# EasyEDA Pro project V2.0.1 Expansion Card.epro

# Schematic V2.0.1 Schematic
Board Name: <System Assignment>; Create Date: 2024-10-24; Page Name: Main Page; Project Name: Access Control Expansion Card; Schematic Name: V2.0.1 Schematic; Update Date: 2024-10-30
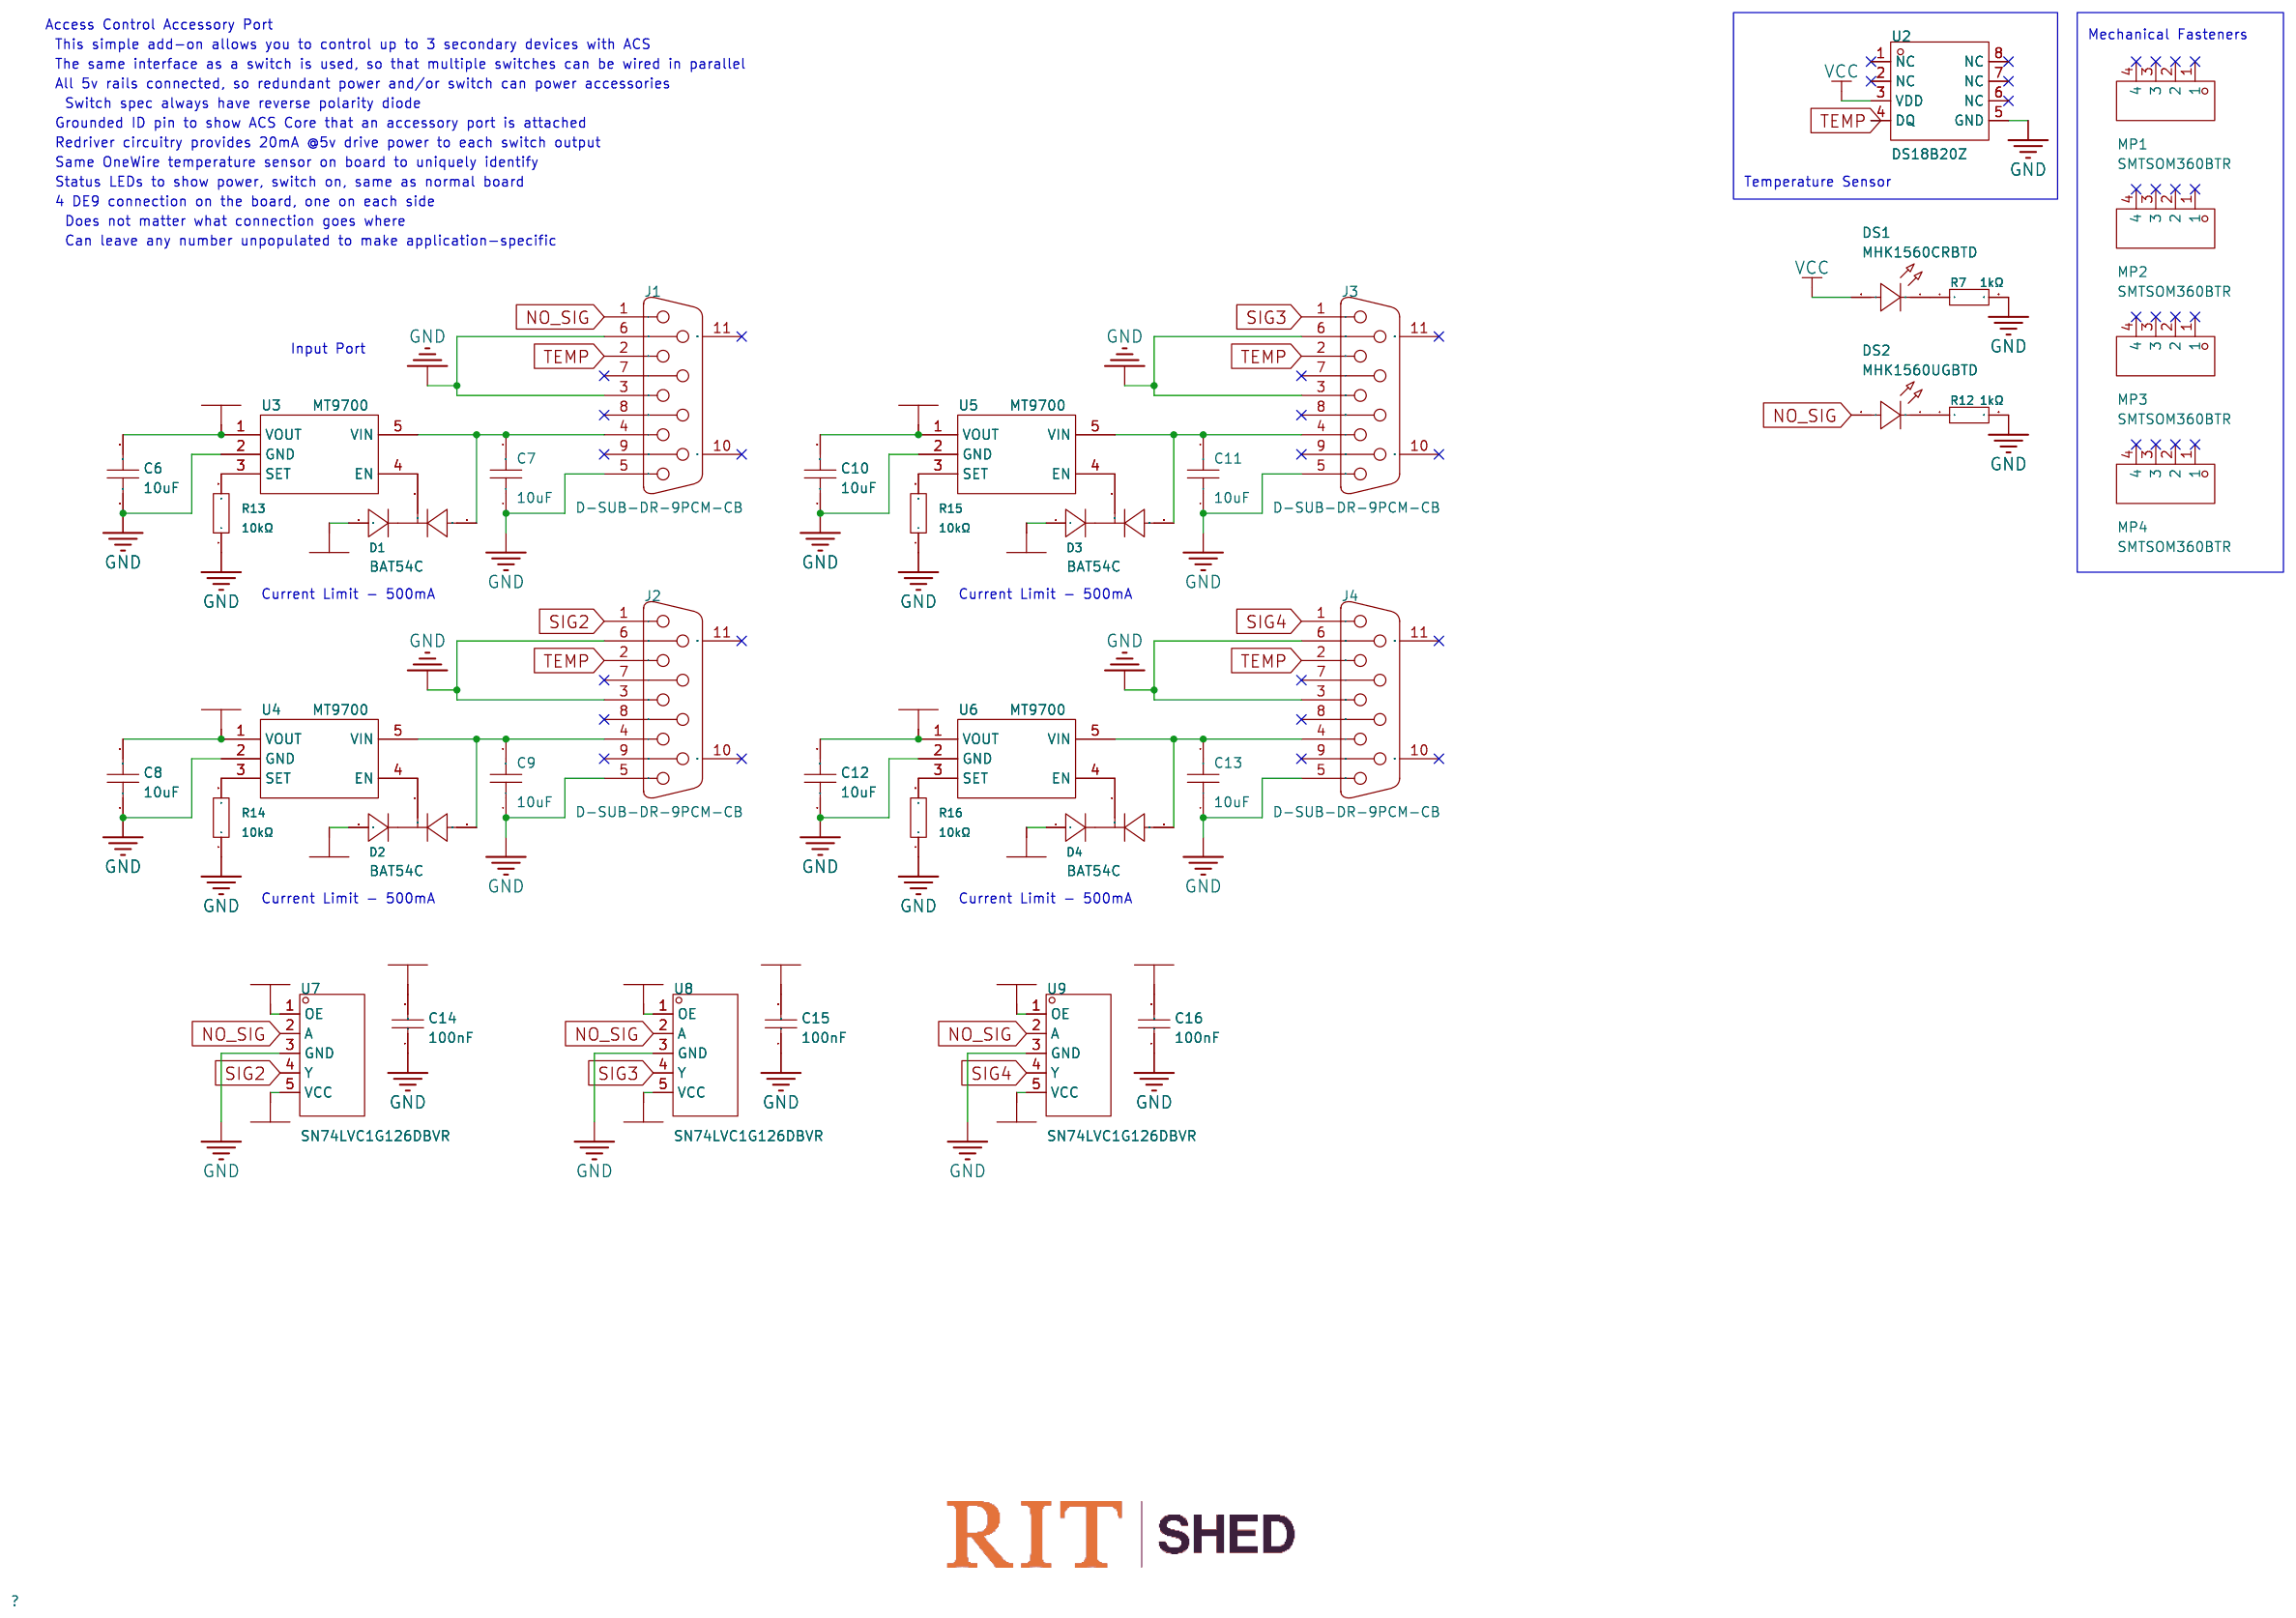
[diagram p0: schematic sheet]

## Parts
C6  10uF  [C0603]
C7  10uF  [C0603]
C8  10uF  [C0603]
C9  10uF  [C0603]
C10  10uF  [C0603]
C11  10uF  [C0603]
C12  10uF  [C0603]
C13  10uF  [C0603]
C14  100nF  [C0603]
C15  100nF  [C0603]
C16  100nF  [C0603]
D1  BAT54C  [SOT-23-3_L2.9-W1.3-P1.90-LS2.4-BR]
D2  BAT54C  [SOT-23-3_L2.9-W1.3-P1.90-LS2.4-BR]
D3  BAT54C  [SOT-23-3_L2.9-W1.3-P1.90-LS2.4-BR]
D4  BAT54C  [SOT-23-3_L2.9-W1.3-P1.90-LS2.4-BR]
DS1  MHK1560CRBTD  [LED-TH_MHK1560UGBTD]
DS2  MHK1560UGBTD  [LED-TH_MHK1560UGBTD]
J1  D-SUB-DR-9PCM-CB  [DB9-TH_ID09S33E4GV00LF]
J2  D-SUB-DR-9PCM-CB  [DB9-TH_ID09S33E4GV00LF]
J3  D-SUB-DR-9PCM-CB  [DB9-TH_ID09S33E4GV00LF]
J4  D-SUB-DR-9PCM-CB  [DB9-TH_ID09S33E4GV00LF]
MP1  SMTSOM360BTR  [SMD_BD5.6-D4.1]
MP2  SMTSOM360BTR  [SMD_BD5.6-D4.1]
MP3  SMTSOM360BTR  [SMD_BD5.6-D4.1]
MP4  SMTSOM360BTR  [SMD_BD5.6-D4.1]
R7  1kΩ  [R0603]
R12  1kΩ  [R0603]
R13  10kΩ  [R0603]
R14  10kΩ  [R0603]
R15  10kΩ  [R0603]
R16  10kΩ  [R0603]
U2  DS18B20Z  [SOP-8_L4.9-W3.9-P1.27-LS6.0-BL]
U3  MT9700  [SOT-23-5_L3.0-W1.7-P0.95-LS2.8-BR]
U4  MT9700  [SOT-23-5_L3.0-W1.7-P0.95-LS2.8-BR]
U5  MT9700  [SOT-23-5_L3.0-W1.7-P0.95-LS2.8-BR]
U6  MT9700  [SOT-23-5_L3.0-W1.7-P0.95-LS2.8-BR]
U7  SN74LVC1G126DBVR  [SOT-23-5_L3.0-W1.7-P0.95-LS2.8-BR]
U8  SN74LVC1G126DBVR  [SOT-23-5_L3.0-W1.7-P0.95-LS2.8-BR]
U9  SN74LVC1G126DBVR  [SOT-23-5_L3.0-W1.7-P0.95-LS2.8-BR]

## Library data of the parts
C6-C13 = CL10A106MA8NRNC: Capacitance: Tolerance:±20% Tolerance:±20% Voltage Rated: Temperature Coefficient:; LCSC Part Name: 10uF ±20% 25V; Supplier Part: C96446; Manufacturer: SAMSUNG(三星); Supplier Footprint: 0603; Datasheet: https://atta.szlcsc.com/upload/public/pdf/source/20170325/1490427913016.pdf; Supplier: LCSC; Tolerance: ±20%
C14-C16 = CL10B104KA8NNNC: Capacitance: Tolerance:±10% Tolerance:±10% Voltage Rated: Temperature Coefficient:; LCSC Part Name: 100nF ±10% 25V; Supplier Part: C1590; Manufacturer: SAMSUNG(三星); Supplier Footprint: 0603; JLCPCB Part Class: Extended Part; Datasheet: https://atta.szlcsc.com/upload/public/pdf/source/20160218/1457707763339.pdf; Supplier: LCSC; Tolerance: ±10%
D1-D4 = BAT54C_C2903788: Diode Configuration: Forward Voltage (Vf@If): Reverse Voltage (Vr): Average Rectified Current (Io): Reverse Leakage Current:2uA@25V; LCSC Part Name: 电压:30V 电流:200mA; Supplier Part: C2903788; Manufacturer: LGE(鲁光); Supplier Footprint: SOT-23; Datasheet: https://atta.szlcsc.com/upload/public/pdf/source/20211009/E66F01CF3E57E3FB5B3EEE30F10FBF56.pdf; Supplier: LCSC; Reverse Leakage Current: 2uA@25V
DS1 = MHK1560CGBTD: 20mA 雾状红透镜 50mcd -40℃~+85℃ 632nm Red 85° 1.75V~2.2V Plugin,P=2.54mm Light Emitting Diodes (LED) ROHS; LCSC Part Name: 1560直插单灯翠绿色光; Supplier Part: C7470835; Manufacturer: MEIHUA(美华); Supplier Footprint: 插件,P=2.54mm; JLCPCB Part Class: Extended Part; Datasheet: https://atta.szlcsc.com/upload/public/pdf/source/20231114/0151DB1F997DCF286213A722D08B4BAA.pdf; Supplier: LCSC; Emitted Color: Emerald; Forward Voltage (VF): 1.75V~2.2V; Forward Current: 20mA; Dominant Wavelength: 520nm; Lens Color: 雾状绿透镜; Luminous Intensity: 1000mcd; Viewing Angle: 85°; Operating Temperature: -40℃~+85℃
DS2 = MHK1560UGBTD: Emitted Color:Emerald Forward Voltage (VF):1.75V~2.2V Forward Voltage (VF):1.75V~2.2V Forward Current:20mA Dominant Wavelength:520nm Dominant Wavelength:520nm Lens Color:雾状绿透镜 Luminous Intensity:1000mcd Luminous Intensity:1000mcd Viewing Angle:85° Operati; LCSC Part Name: 1560直插单灯翠绿色光; Supplier Part: C7470833; Manufacturer: MEIHUA(美华); Supplier Footprint: 插件,P=2.54mm; JLCPCB Part Class: Extended Part; Datasheet: https://atta.szlcsc.com/upload/public/pdf/source/20231114/0151DB1F997DCF286213A722D08B4BAA.pdf; Supplier: LCSC; Emitted Color: Emerald; Forward Voltage (VF): 1.75V~2.2V; Forward Current: 20mA; Dominant Wavelength: 520nm; Lens Color: 雾状绿透镜; Luminous Intensity: 1000mcd; Viewing Angle: 85°; Operating Temperature: -40℃~+85℃
J1-J4 = D-SUB-DR-9PCM-CB: Connector Type:D-Sub Gender:Female Number of Pins:9P Mounting Style:Right-Angle Number of Rows:2 Current Rating (Max):3A Contact Plating:Tin Operating Temperature Range:-50℃~+105℃ Operating Temperature Range:-50℃~+105℃; LCSC Part Name: D-Sub 母 P数:9P; Supplier Part: C19077337; Manufacturer: XUNPU(讯普); Supplier Footprint: 弯插; JLCPCB Part Class: Extended Part; Datasheet: https://atta.szlcsc.com/upload/public/pdf/source/20231108/FB2E8AB0BE4F620DDF3F7F4D0B9AFB97.pdf; Supplier: LCSC; Connector Type: D-Sub; Gender: Female; Number of Pins: 9P; Mounting Style: Right-Angle; Number of Rows: 2; Current Rating (Max): 3A; Contact Plating: Tin; Operating Temperature Range: -50℃~+105℃
MP1-MP4 = SMTSOM360BTR: LCSC Part Name: YIYUAN(怡远)M3贴片螺母 铜镀锡 PCB贴片连接器SMTSOM360BTR; Supplier Part: C5221846; Manufacturer: YIYUAN(怡远); JLCPCB Part Class: Extended Part; Datasheet: https://atta.szlcsc.com/upload/public/pdf/source/20230202/A42D22DA7D93D728E13784C4003E4077.pdf; Supplier: LCSC
R7 R12 = 0603WAF1001T5E: Type:Thick Film Resistors Resistance:1kΩ Tolerance:±1% Tolerance:±1% Power(Watts): Overload Voltage (Max): Temperature Coefficient:±100ppm/℃ Temperature Coefficient:±100ppm/℃ Operating Temperature Range:-55℃~+155℃ Operating Temperature Range:-55℃~+155℃; LCSC Part Name: 1kΩ ±1% 100mW 厚膜电阻; Supplier Part: C21190; Manufacturer: UNI-ROYAL(厚声); Supplier Footprint: 0603; JLCPCB Part Class: Basic Part; Datasheet: https://atta.szlcsc.com/upload/public/pdf/source/20200306/C422600_1E6D84923E4A46A82E41ADD87F860B5C.pdf; Supplier: LCSC; Type: Thick Film Resistors; Tolerance: ±1%; Temperature Coefficient: ±100ppm/℃; Operating Temperature Range: -55℃~+155℃
R13-R16 = 0603WAF1002T5E: Type:Thick Film Resistors Resistance:10kΩ Tolerance:±1% Tolerance:±1% Power(Watts): Overload Voltage (Max): Temperature Coefficient:±100ppm/℃ Temperature Coefficient:±100ppm/℃ Operating Temperature Range:-55℃~+155℃ Operating Temperature Range:-55℃~+155℃; LCSC Part Name: 厚膜电阻 10kΩ ±1% 100mW; Supplier Part: C25804; Manufacturer: UNI-ROYAL(厚声); Supplier Footprint: 0603; JLCPCB Part Class: Basic Part; Datasheet: https://atta.szlcsc.com/upload/public/pdf/source/20200306/C422600_1E6D84923E4A46A82E41ADD87F860B5C.pdf; Supplier: LCSC; Type: Thick Film Resistors; Tolerance: ±1%; Temperature Coefficient: ±100ppm/℃; Operating Temperature Range: -55℃~+155℃
U2 = DS18B20Z: Resolution:±0.4℃ Resolution:±0.4℃ Supply Voltage:2.5V~5.5V Supply Voltage:2.5V~5.5V; LCSC Part Name: 温度传感器; Supplier Part: C695837; Manufacturer: UMW(友台半导体); Supplier Footprint: SOIC-8; JLCPCB Part Class: Extended Part; Datasheet: https://atta.szlcsc.com/upload/public/pdf/source/20231109/DC3DA9D47D486EF40A6E0F08B9A498E3.pdf; Supplier: LCSC; Resolution: ±0.4℃; Supply Voltage: 2.5V~5.5V
U3-U6 = MT9700: Supplier Part: C89855; Manufacturer: 西安航天民芯; Supplier Footprint: SOT-23-5; Datasheet: https://atta.szlcsc.com/upload/public/pdf/source/20170418/1492481333031.pdf; Supplier: LCSC
U7-U9 = SN74LVC1G126DBVR: Input type:- output type:Tri-State Supply Voltage:1.65V~5.5V Supply Voltage:1.65V~5.5V Number of Elements:1 Number of Bits per Element:1 Sink Current:32mA Source Current:32mA Logic Family:74LVC Operating Temperature:-40℃~+125℃ Operating Temperature:-40℃~+; Supplier Part: C7834; Manufacturer: TI(德州仪器); Supplier Footprint: SOT-23-5; JLCPCB Part Class: Extended Part; Datasheet: https://www.ti.com/cn/lit/gpn/sn74lvc1g126; Supplier: LCSC; output type: Tri-State; Supply Voltage: 1.65V~5.5V; Number of Elements: 1; Number of Bits per Element: 1; Sink Current: 32mA; Source Current: 32mA; Logic Family: 74LVC; Operating Temperature: -40℃~+125℃

## Nets
GND: C6.1 C7.1 C8.1 C9.1 C10.1 C11.1 C12.1 C13.1 C14.1 C15.1 C16.1 J1.3 J1.5 J1.6 J2.3 J2.5 J2.6 J3.3 J3.5 J3.6 J4.3 J4.5 J4.6 R7.2 R12.2 R13.1 R14.1 R15.1 R16.1 U2.5(GND) U3.2(GND) U4.2(GND) U5.2(GND) U6.2(GND) U7.3(GND) U8.3(GND) U9.3(GND)
VCC: C6.2 C8.2 C10.2 C12.2 C14.2 C15.2 C16.2 D1.1 D2.1 D3.1 D4.1 DS1.2(A) U2.3(VDD) U3.1(VOUT) U4.1(VOUT) U5.1(VOUT) U6.1(VOUT) U7.1(OE) U7.5(VCC) U8.1(OE) U8.5(VCC) U9.1(OE) U9.5(VCC)
NO_SIG: DS2.2(A) J1.1 U7.2(A) U8.2(A) U9.2(A)
SIG2: J2.1 U7.4(Y)
SIG3: J3.1 U8.4(Y)
SIG4: J4.1 U9.4(Y)
TEMP: J1.2 J2.2 J3.2 J4.2 U2.4(DQ)
$1N525: DS1.1(K) R7.1
$1N526: DS2.1(K) R12.1
$1N975: C7.2 D1.2 J1.4 U3.5(VIN)
$1N978: R13.2 U3.3(SET)
$1N2462: D1.3 U3.4(EN)
$1N2824: C9.2 D2.2 J2.4 U4.5(VIN)
$1N2841: R14.2 U4.3(SET)
$1N2842: D2.3 U4.4(EN)
$1N3882: C11.2 D3.2 J3.4 U5.5(VIN)
$1N3899: R15.2 U5.3(SET)
$1N3900: D3.3 U5.4(EN)
$1N3902: R16.2 U6.3(SET)
$1N3903: D4.3 U6.4(EN)
$1N3915: C13.2 D4.2 J4.4 U6.5(VIN)

Not connected (* = marked no-connect by the designer): J1 7* 8* 9* 10(MH1)* 11(MH2)*; J2 7* 8* 9* 10(MH1)* 11(MH2)*; J3 7* 8* 9* 10(MH1)* 11(MH2)*; J4 7* 8* 9* 10(MH1)* 11(MH2)*; MP1 1* 2* 3* 4*; MP2 1* 2* 3* 4*; MP3 1* 2* 3* 4*; MP4 1* 2* 3* 4*; U2 1(NC)* 2(NC)* 6(NC)* 7(NC)* 8(NC)*

## Notes on the sheet
- Access Control Accessory Port
- Mechanical Fasteners
- This simple add-on allows you to control up to 3 secondary devices with ACS
- All 5v rails connected, so redundant power and/or switch can power accessories
- The same interface as a switch is used, so that multiple switches can be wired in parallel
- Switch spec always have reverse polarity diode
- Grounded ID pin to show ACS Core that an accessory port is attached
- Redriver circuitry provides 20mA @5v drive power to each switch output
- Same OneWire temperature sensor on board to uniquely identify
- 4 DE9 connection on the board, one on each side
- Status LEDs to show power, switch on, same as normal board
- Temperature Sensor
- Does not matter what connection goes where
- Can leave any number unpopulated to make application-specific
- Input Port
- Current Limit - 500mA
- Current Limit - 500mA
- Current Limit - 500mA
- Current Limit - 500mA

# Board PCB1
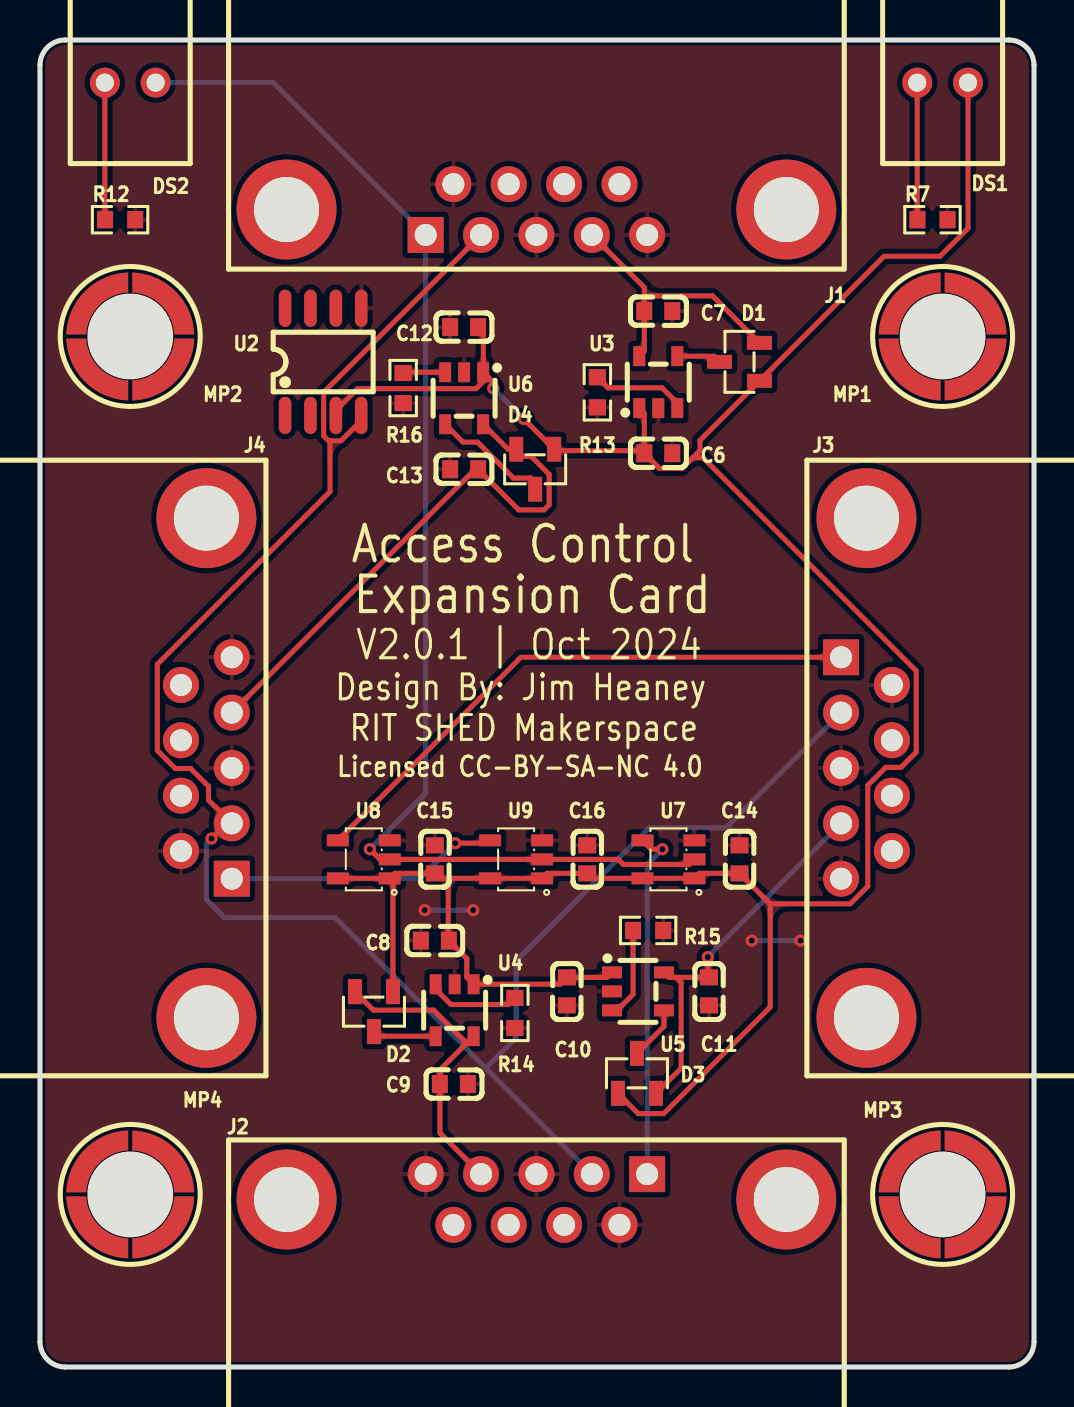
[diagram p1: board, top side]
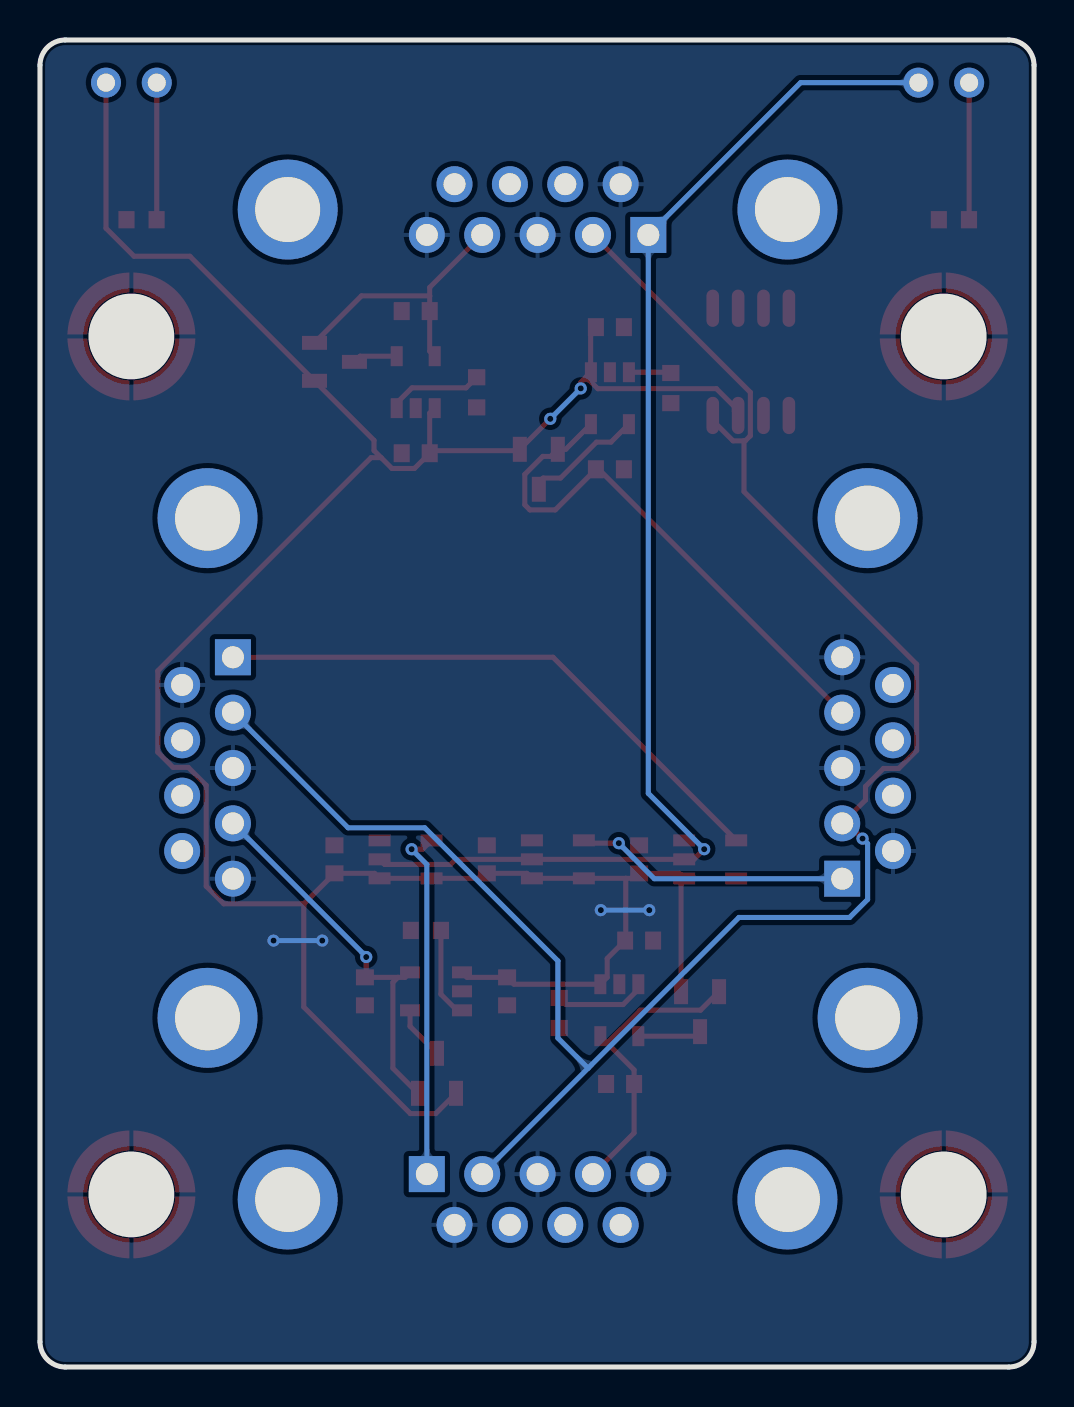
[diagram p2: board, bottom side, seen from below]

Outline 49.73 x 66.4 mm; copper layers: Top Layer, Bottom Layer. Coordinates in mm from the lower left corner of the outline.
Outline path: 0,65.13 0,1.27 arc(0.37,0.37) 1.27,0 48.46,0 arc(49.36,0.37) 49.73,1.27 49.73,65.13 arc(49.36,66.02) 48.46,66.4 1.27,66.4 arc(0.37,66.02) 0,65.13
Stack: Top Layer 0.035mm / Dielectric1 1.51mm FR4 er 4.5 / Bottom Layer 0.035mm

## Design rules (mm)
template: Custom Config
spacing copperThickness1oz (default): track to track 0.152, other pairs 0.152 to 0.3
spacing copperThickness2oz: track to track 0.203, other pairs 0.152 to 0.3
track width copperThickness1oz (default): min 0.127, default 0.254, max 2.54
track width copperThickness2oz: min 0.203, default 0.254, max 2.54
differential pair differentialPair (default): width min 0.127, default 0.254, max 2.54; gap min 0.152, default 0.152
via viaSize (default): diameter min 0.5, default 0.61, max 10; hole min 0.3, default 0.305, max 6.3

## Placement (name value [footprint] x y rotation side)
C6  10uF  [C0603]  30.93 45.72 180 top
C7  10uF  [C0603]  30.93 52.83 180 top
C8  10uF  [C0603]  19.76 21.34 0 top
C9  10uF  [C0603]  20.71 14.16 180 top
C10  10uF  [C0603]  26.36 18.8 90 top
C11  10uF  [C0603]  33.47 18.8 90 top
C12  10uF  [C0603]  21.22 52.03 0 top
C13  10uF  [C0603]  21.22 44.92 0 top
C14  100nF  [C0603]  35 25.4 270 top
C15  100nF  [C0603]  19.76 25.4 270 top
C16  100nF  [C0603]  27.38 25.4 270 top
D1  BAT54C  [SOT-23-3_L2.9-W1.3-P1.90-LS2.4-BR]  35 50.29 0 top
D2  BAT54C  [SOT-23-3_L2.9-W1.3-P1.90-LS2.4-BR]  16.71 17.78 90 top
D3  BAT54C  [SOT-23-3_L2.9-W1.3-P1.90-LS2.4-BR]  29.87 14.69 270 top
D4  BAT54C  [SOT-23-3_L2.9-W1.3-P1.90-LS2.4-BR]  24.77 44.92 90 top
DS1  MHK1560CRBTD  [LED-TH_MHK1560UGBTD]  45.16 64.26 180 top
DS2  MHK1560UGBTD  [LED-TH_MHK1560UGBTD]  4.52 64.26 180 top
J1  D-SUB-DR-9PCM-CB  [DB9-TH_ID09S33E4GV00LF]  24.83 57.91 180 top
J2  D-SUB-DR-9PCM-CB  [DB9-TH_ID09S33E4GV00LF]  24.83 8.38 0 top
J3  D-SUB-DR-9PCM-CB  [DB9-TH_ID09S33E4GV00LF]  41.35 29.97 90 top
J4  D-SUB-DR-9PCM-CB  [DB9-TH_ID09S33E4GV00LF]  8.33 29.97 270 top
MP1  SMTSOM360BTR  [SMD_BD5.6-D4.1]  45.16 51.56 0 top
MP2  SMTSOM360BTR  [SMD_BD5.6-D4.1]  4.52 51.56 0 top
MP3  SMTSOM360BTR  [SMD_BD5.6-D4.1]  45.16 8.64 0 top
MP4  SMTSOM360BTR  [SMD_BD5.6-D4.1]  4.52 8.64 0 top
R7  1kΩ  [R0603]  44.65 57.4 0 top
R12  1kΩ  [R0603]  4.01 57.4 0 top
R13  10kΩ  [R0603]  27.88 48.77 90 top
R14  10kΩ  [R0603]  23.76 17.72 90 top
R15  10kΩ  [R0603]  30.42 21.84 180 top
R16  10kΩ  [R0603]  18.17 48.98 90 top
U2  DS18B20Z  [SOP-8_L4.9-W3.9-P1.27-LS6.0-BL]  14.17 50.29 0 top
U3  MT9700  [SOT-23-5_L3.0-W1.7-P0.95-LS2.8-BR#2]  30.93 49.28 270 top
U4  MT9700  [SOT-23-5_L3.0-W1.7-P0.95-LS2.8-BR#2]  20.74 17.85 90 top
U5  MT9700  [SOT-23-5_L3.0-W1.7-P0.95-LS2.8-BR#2]  29.92 18.8 180 top
U6  MT9700  [SOT-23-5_L3.0-W1.7-P0.95-LS2.8-BR#2]  21.22 48.47 90 top
U7  SN74LVC1G126DBVR  [SOT-23-5_L3.0-W1.7-P0.95-LS2.8-BR]  31.44 25.4 0 top
U8  SN74LVC1G126DBVR  [SOT-23-5_L3.0-W1.7-P0.95-LS2.8-BR]  16.2 25.4 0 top
U9  SN74LVC1G126DBVR  [SOT-23-5_L3.0-W1.7-P0.95-LS2.8-BR]  23.82 25.4 0 top

## Footprints (pads in the part's own frame, mm; a bottom-side part is the same pattern mirrored in y, then rotated)
C0603
  rect 0.8x0.9 smd: 1(-0.7,0) 2(0.7,0)
DB9-TH_ID09S33E4GV00LF
  rect 1.8x1.8 hole 1.1: 1(5.54,1.27)
  round 1.8 hole 1.1: 2(2.77,1.27) 3(0,1.27) 4(-2.77,1.27) 5(-5.54,1.27) 6(4.155,-1.27) 7(1.385,-1.27) 8(-1.385,-1.27) 9(-4.155,-1.27)
  round 5 hole 3.25: 10(-12.5,0) 11(12.5,0)
LED-TH_MHK1560UGBTD
  round 1.5 hole 0.9: 1(1.27,0) 2(-1.27,0)
R0603
  rect 0.806x0.864 smd: 1(-0.753,0) 2(0.753,0)
SMD_BD5.6-D4.1
  custom 3.1x3.1 smd: 1(-2.102,1.65) 2(1.65,2.102) 3(2.102,-1.65) 4(-1.65,-2.102)
SOP-8_L4.9-W3.9-P1.27-LS6.0-BL
  oval 0.63x1.865 smd: 1(-1.905,-2.683) 2(-0.635,-2.683) 3(0.635,-2.683) 4(1.905,-2.683) 5(1.905,2.683) 6(0.635,2.683) 7(-0.635,2.683) 8(-1.905,2.683)
SOT-23-3_L2.9-W1.3-P1.90-LS2.4-BR
  rect 1.25x0.7 smd: 1(1,-0.95) 2(1,0.95) 3(-1,0)
SOT-23-5_L3.0-W1.7-P0.95-LS2.8-BR
  rect 1.1x0.6 smd: 1(1.3,-0.95) 2(1.3,0) 3(1.3,0.95) 4(-1.3,0.95) 5(-1.3,-0.95)
SOT-23-5_L3.0-W1.7-P0.95-LS2.8-BR#2
  rect 1x0.6 smd: 1(1.3,-0.95) 2(1.3,0) 3(1.3,0.95) 4(-1.3,0.95) 5(-1.3,-0.95)

## Nets
As in the schematic.

Pads without a net: J1 7 8 9 10 11; J2 7 8 9 10 11; J3 7 8 9 10 11; J4 7 8 9 10 11; MP1 1 2 3 4; MP2 1 2 3 4; MP3 1 2 3 4; MP4 1 2 3 4; U2 1 2 6 7 8

## Via types
v1: diameter 0.61, hole 0.305, Top Layer to Bottom Layer, 11 vias

## Routing (per net, layer and track width the routed paths; a pad name or vN(x,y) marks a point on that pad's centre or on a via; arc(x,y) is an arc through that point)
GND: length 4.9
  Bottom Layer w0.254: v1(21.67,22.86) v1(19.25,22.86) ; v1(35.61,21.34) v1(38.04,21.34)
VCC: length 142.3
  Top Layer w0.254: 22.41,49.53 22.67,49.26 v1(22.67,48.96) ; 22.41,49.53 22.18,49.76 ; 22.41,49.53 21.82,48.95 15.89,48.95 14.99,48.05 14.99,47.8 U2.3 ; U5.1 28.36,19.5 C10.2 26.02,19.15 U4.1 21.35,19.49 21.35,20.44 C8.2 20.42,21.37 20.42,24.45 ; 17.37,24.45 17.66,24.17 D2.1 ; 17.37,24.45 U8.1 17.75,24.7 C15.2 20.01,24.45 20.42,24.45 ; 17.37,24.45 U8.5 ; D3.1 29.93,12.68 31.2,12.68 36.53,18.01 36.53,23.18 ; 30.23,45.85 C6.2 30.99,44.96 32.12,44.96 32.66,45.5 ; 30.23,45.85 30.23,47.73 U3.1 ; 30.23,45.85 25.79,45.85 D4.1 v1(24.2,47.44) ; 22.18,49.76 22.18,51.76 C12.2 ; 22.18,49.76 U6.1 ; 32.66,45.5 33.17,45.5 43.83,34.83 43.83,30.77 43.07,30 42.31,30 41.41,29.11 41.41,24.06 40.53,23.18 36.53,23.18 ; 32.66,45.5 33.02,45.86 33.02,46.36 D1.1 42.23,55.57 45.02,55.57 46.42,56.98 DS1.2 ; 20.42,24.45 U9.5 U9.1 25.37,24.7 C16.2 27.63,24.45 U7.5 U7.1 32.99,24.7 C14.2 36.52,23.18 36.53,23.18
  Bottom Layer w0.254: v1(24.2,47.44) v1(22.67,48.96)
NO_SIG: length 65.2
  Top Layer w0.254: v1(16.5,25.91) 17.01,25.4 U8.2 U9.2 28.93,25.4 29.18,25.15 32.48,25.15 U7.2
  Bottom Layer w0.254: DS2.2 11.67,64.26 J1.1 19.3,28.7 v1(16.5,25.91)
SIG2: length 17.8
  Top Layer w0.254: v1(31.14,25.91) 30.58,25.91 U7.4
  Bottom Layer w0.254: J2.1 30.38,25.15 v1(31.14,25.91)
SIG3: length 29
  Top Layer w0.254: U8.4 24.06,35.51 J3.1
SIG4: length 13.7
  Top Layer w0.254: U9.4 22.38,26.21 v1(20.77,26.21)
  Bottom Layer w0.254: v1(20.77,26.21) 18.99,24.43 J4.1
TEMP: length 97.5
  Top Layer w0.254: 14.51,46.34 14.51,43.8 5.87,35.16 5.87,30.85 6.77,29.95 7.53,29.95 8.43,29.05 8.43,28.37 J4.2 9.34,27.2 v1(8.58,26.44) ; 14.51,46.34 15.06,46.34 15.95,47.24 15.95,47.49 U2.4 ; 14.51,46.34 14.45,46.34 14.19,46.59 14.19,48.77 J1.2
  Bottom Layer w0.254: J3.2 34.31,26.98 30.48,26.98 23.82,20.32 23.82,16.46 22.31,14.95 ; 22.31,14.95 14.76,22.49 9.22,22.49 8.33,23.39 8.33,26.19 v1(8.58,26.44) ; 22.31,14.95 J2.2
$1N525: length 6.9
  Top Layer w0.254: DS1.1 43.89,57.41 R7.1
$1N526: length 6.9
  Top Layer w0.254: DS2.1 3.25,57.41 R12.1
$1N975: length 14
  Top Layer w0.254: 30.23,53.59 C7.2 30.23,50.83 U3.5 ; 30.23,53.59 33.64,53.59 D1.2 ; 30.23,53.59 30.23,54.02 J1.4
$1N978: length 4.8
  Top Layer w0.254: R13.2 28.41,48.99 31.12,48.99 31.88,48.23 U3.3
$1N2462: length 2.2
  Top Layer w0.254: D1.3 33.71,50.58 U3.4
$1N2824: length 15.2
  Top Layer w0.254: 21.22,16.08 21.22,16.33 19.7,17.86 16.68,17.86 D2.2 ; 21.22,16.08 U4.5 ; 21.22,16.08 20.01,14.86 C9.2 20.01,11.71 J2.4
$1N2841: length 4.7
  Top Layer w0.254: R14.2 23.42,18.14 20.56,18.14 19.79,18.9 U4.3
$1N2842: length 3.2
  Top Layer w0.254: D2.3 16.94,16.55 U4.4
$1N3882: length 19.3
  Top Layer w0.254: 33.41,19.5 v1(33.41,20.51) ; 33.41,19.5 31.82,19.5 ; 33.41,19.5 C11.2 ; 31.82,19.5 32.07,19.24 32.07,14.95 D3.2 ; 31.82,19.5 31.47,19.5 U5.5
  Bottom Layer w0.254: J3.4 33.41,20.53 v1(33.41,20.51)
$1N3899: length 4.6
  Top Layer w0.254: U5.3 28.87,17.85 29.67,18.65 R15.2
$1N3900: length 2.7
  Top Layer w0.254: U5.4 31.22,17.04 D3.3
$1N3902: length 2.1
  Top Layer w0.254: U6.3 18.21,49.77 R16.2
$1N3903: length 6.1
  Top Layer w0.254: U6.4 21.17,46.27 21.89,46.27 23.69,44.48 24.55,44.48 24.77,44.26 D4.3
$1N3915: length 27.7
  Top Layer w0.254: J4.4 21.77,44.92 C13.2 23.95,42.88 25.22,42.88 25.47,43.14 25.47,44.66 24.58,45.56 24.18,45.56 D4.2 23.42,45.92 U6.5

## Copper pours and planes (outline as drawn; the poured copper is in the pictures)
GND on Top Layer: -0.56,72.14 51.25,72.14 51.25,-3.56 -0.56,-3.56
GND on Bottom Layer: -9.2,67.56 58.87,67.56 58.87,-1.52 -9.2,-1.52

Small or netless copper shapes (teardrops, artwork), in the pictures only: 99 on Top Layer, 20 on Bottom Layer

## Text on the board
Top Silkscreen Layer: Licensed CC-BY-SA-NC 4.0 | Design By: Jim Heaney | RIT SHED Makerspace | V2.0.1 | Oct 2024 | Access Control | Expansion Card
